# Altium schematic sheet NGUON.SchDoc
size 254 x 241 mm
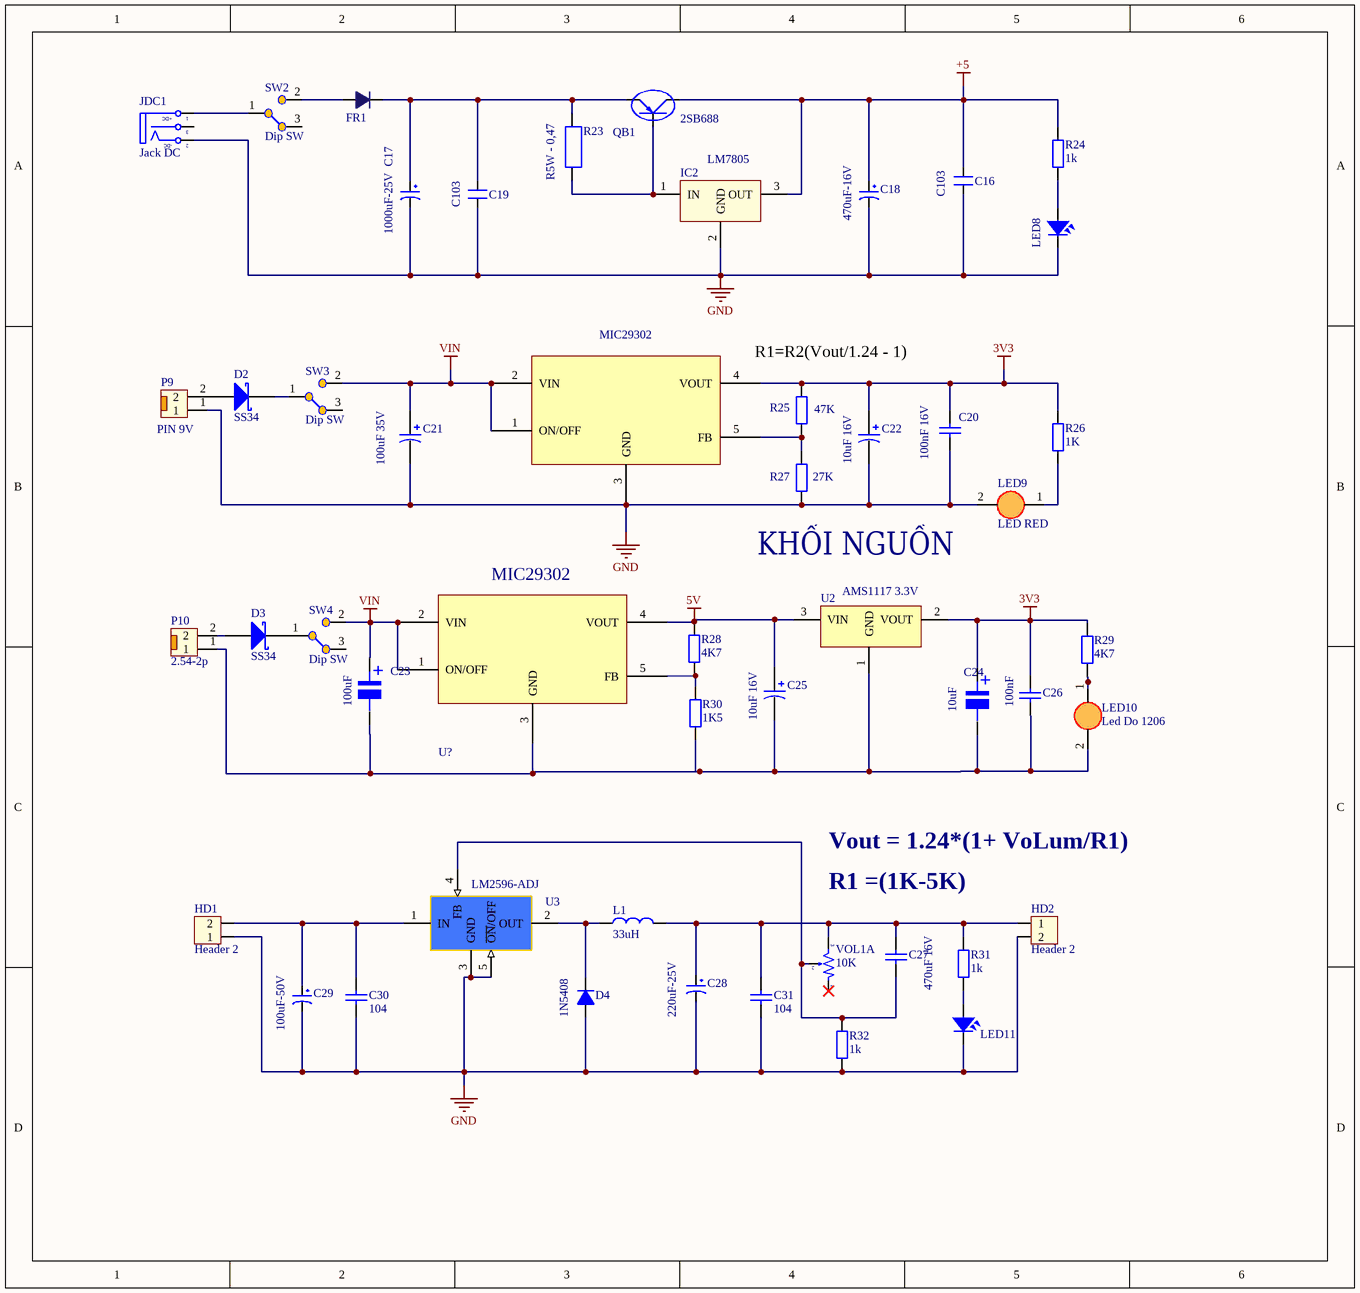
[diagram p0: NGUON.SchDoc]

## Parts
C16  C103  [CN1]
C17  1000uF-25V  [tu hoa 13mm]
C18  470uF-16V  [tu hoa 8mm]
C19  C103  [CN1]
C20  100nF 16V  [tu 0805]
C21  100uF 35V  [CAP_ALUM_SMD_100102_TYPE_G]
C22  10uF 16V  [CAP_ALUM_SMD_5054_TYPE_C]
C23  100uF  [tu nhom 10 (g)]
C24  10uF  [tu nhom 4 (b)]
C25  10uF 16V  [CAP_ALUM_SMD_5054_TYPE_C]
C26  100nF  [tu 0805]
C27  470uF 16V  [tu gom]
C28  220uF-25V  [Tu hoa 8mm]
C29  100uF-50V  [tu hoa 8mm]
C30  104  [tu gom]
C31  104  [tu gom]
D2  SS34  [DIODE_DO214AC_SMA]
D3  SS34  [DIODE_DO214AC_SMA]
D4  1N5408  [D5A]
FR1  Diode FR307  [FR307]  (value not drawn)
HD1  Header 2  [HED2]
HD2  Header 2  [HED2]
IC2  LM7805  [QTO-220H3]
JDC1  Jack DC  [DC-IN]
L1  33uH  [R1/4W]
LED8  LED  [LED-5-RED]  (value not drawn)
LED9  LED RED  [led 0805]
LED10  Led Do 1206  [led 1206]
LED11  LED  [LED-5-RED]  (value not drawn)
MIC2  MIC29302  [Mic5V]
MIC3  U?  [Mic5V]
P9  PIN 9V  [Header Duc Thang 2P 2.54]
P10  2.54-2p  [Header Duc Thang 2P 2.54]
QB1  2SB688  [QTO-247]
R23  R5W - 0,47  [R5W]
R24  1k  [R1/4W]
R25  47K  [tro 0805]
R26  1K  [tro 0805]
R27  27K  [tro 0805]
R28  4K7  [tro 0805]
R29  4K7  [tro 0805]
R30  1K5  [tro 0805]
R31  1k  [R1/4W]
R32  1k  [R1/4W]
SW2  Dip SW  [SW3P]
SW3  Dip SW  [SW3P]
SW4  Dip SW  [SW3P]
U2  AMS1117 3.3V  [SOT223]
U3  LM2596-ADJ  [D2-PACK5]
VOL1  10K  [VR1]  (part A of 2)

## Nets
3V3: C20.1 C22.1 C24.1 C26.1 MIC2.4(VOUT) R25.1 R26.2 R29.1 U2.2(VOUT)
5V: C25.1 MIC3.4(VOUT) R28.2 U2.3(VIN)
+5: C16.2 C18.1 IC2.3(OUT) QB1.2(C) R24.2
GND: C16.1 C17.2 C18.2 C19.1 C20.2 C21.2 C22.2 C28.2 C29.2 C30.2 C31.2 D4.1(A) HD1.1 HD2.2 IC2.2(GND) JDC1.2(TN) LED8.2 LED9.2(K) LED11.2 MIC2.3(GND) P9.1 R27.2 R32.1 U3.3(GND) U3.5(~{ON}/OFF)
VIN: C21.1 C23.1 MIC2.1(ON/OFF) MIC2.2(VIN) MIC3.1(ON/OFF) MIC3.2(VIN) SW3.2(NC) SW4.2(NC)
NetC17_1: C17.1 C19.2 FR1.2(K) QB1.3(E) R23.2
NetC23_2: C23.2 C24.2 C25.2 C26.2 LED10.2(K) MIC3.3(GND) P10.1 R30.1 U2.1(GND)
NetC27_1: C27.1 C28.1 C31.1 HD2.1 L1.2 R31.2 VOL1.3
NetC27_2: C27.2 R32.2 U3.4(FB) VOL1.2
NetC29_1: C29.1 C30.1 HD1.2 U3.1(IN)
NetD2_1: D2.1(A) P9.2
NetD2_2: D2.2(K) SW3.1(COM)
NetD3_1: D3.1(A) P10.2
NetD3_2: D3.2(K) SW4.1(COM)
NetD4_2: D4.2(K) L1.1 U3.2(OUT)
NetFR1_1: FR1.1(A) SW2.2(NC)
NetIC2_1: IC2.1(IN) QB1.1(B) R23.1
NetJDC1_1: JDC1.1(T) SW2.1(COM)
NetLED8_1: LED8.1 R24.1
NetLED9_1: LED9.1(A) R26.1
NetLED10_1: LED10.1(A) R29.2
NetLED11_1: LED11.1 R31.1
NetMIC2_5: MIC2.5(FB) R25.2 R27.1
NetMIC3_5: MIC3.5(FB) R28.1 R30.2

Not connected (* = marked no-connect by the designer): JDC1 3(S); SW2 3(NO); SW3 3(NO); SW4 3(NO); VOL1 1*

## Notes on the sheet
- R1=R2(Vout/1.24 - 1)
- KHỐI NGUỒN
- (near MIC3) MIC29302
- Vout = 1.24*(1+ VoLum/R1)
- R1 =(1K-5K)
- (in symbol Jack DC) +DC; -DC
- (in symbol Tu Nhom 10uF 16V) +
- (in symbol Tu Nhom 100uF 35V) +

## Library data of the parts
C16 C19 = CN1: Cap np  1pF - 472pF; Value: 100pF
C17 = Tu Hoa 1000uF 25V 13x21: Cắm; Don_Vi: Con; So_Chan: 2; Ten_Linh_Kien: Tụ Hóa 1000uF 25V 13x21MM; Ma_Hang: MH002315; Chung_Loai: Cắm; Kieu_Chan: *
C18 = Tu Hoa 470uF 16V 8x11: Cắm; Don_Vi: Con; So_Chan: 2; Ten_Linh_Kien: Tụ Hóa 470uF 16V 8x11MM; Ma_Hang: MH006550; Chung_Loai: Cắm; Kieu_Chan: *
C20 = Tu 0805 22pF 50V 10%: Dán; Don_Vi: Con; So_Chan: 2; Ten_Linh_Kien: Tụ 0805 22P 10% 50V; Ma_Hang: MH004560; Chung_Loai: Dán; Kieu_Chan: *
C21 = EEE-FK1C331P: CAP ALUM 330uF 20% 35V SMD; MFR: Panasonic; Value: 330uF/35V; Solder: SMT; MPN: EEE-FK1C331P; Category: CAPACITOR; PinCount: 2
C22 C25 = EEE-FK1C330P: CAP ALUM 33uF 20% 16V SMD; MFR: Panasonic; Value: 33uF/16V; Solder: SMT; MPN: EEE-FK1C330P; Category: CAPACITOR; PinCount: 2
C23 = Tu Nhom 100uF 35V: Dán; Don_Vi: Con; Ten_Linh_Kien: Tụ Nhôm 100uF 35V; Ma_Hang: MH004019; So_Chan: 2; Chung_Loai: Dán; Kieu_Chan: *
C24 = Tu Nhom 10uF 16V: Dán; Don_Vi: Con; So_Chan: 2; Ten_Linh_Kien: Tụ Nhôm 10uF 16V 4x5MM; Ma_Hang: MH001458; Chung_Loai: Dán; Kieu_Chan: *
C26 = Tu 0805 220nF 50V 10%: Dán; Don_Vi: Con; So_Chan: 2; Ten_Linh_Kien: Tụ 0805 220nF 50V 10%; Ma_Hang: MH008099; Chung_Loai: Dán; Kieu_Chan: *
C27 C30 C31 = Tu gom 100 50V: Cắm; Don_Vi: Con; So_Chan: 2; Ten_Linh_Kien: Tụ gốm 100 10pF 50V; Ma_Hang: MH004765; Chung_Loai: Cắm; Kieu_Chan: *
C28 = Tu Hoa 220uF 25V 8x10: Cắm; Don_Vi: Con; So_Chan: 2; Ten_Linh_Kien: Tụ Hóa 220uF 25V 8x10MM; Ma_Hang: MH006864; Chung_Loai: Cắm; Kieu_Chan: *
C29 = Tu Hoa 100uF 50V 8x11: Cắm; Don_Vi: Con; So_Chan: 2; Ten_Linh_Kien: Tụ Hóa 100uF 50V 8x11MM; Ma_Hang: MH006872; Chung_Loai: Cắm; Kieu_Chan: *
D2 D3 = SS34: DIODE SCHOTTKY 40V 3A SMA; Solder: SMT; MPN: SS34; Value: SS34; MFR: *
D4 = D5A: Diode 5A; Value: 1N5408
FR1 = Diode FR307: Diode RECT FAST REC 1000V 3A DO-201AD; Vendor: Digikey; Current: 3Amp; Published: 8-Jun-2000; LatestRevisionDate: 17-Jul-2002; LatestRevisionNote: Re-released for DXP Platform.; DatasheetDocument: 1997; PackageReference: DO-35; Publisher: Altium Limited; Code_JEDEC: DO-204-AH; ComponentLink1Description: Digikey Part Link; ComponentLink1URL: http://www.fairchildsemi.com/; ComponentLink2Description: Open Datasheet; ComponentLink2URL: H:\LIBRARY\LIBRARY.Datasheet\ds26003.pdf; Value: FR307
HD1 HD2 = Hed2: Header 2 (Green); Value: Header 2
IC2 = LM78xx: On ap +, from + 5 to + 24VDC; Value: LM7805
JDC1 = Jack DC: Cắm; Ten_Linh_Kien: Jack DC5.5x2.1MM DC5501; Ma_Hang: MH000923; Don_Vi: Con; Kieu_Chan: *; Ghi_Chu: *; Chung_Loai: Cắm
L1 = Cuon cam 220uH: Cắm; So_Chan: 2; Ten_Linh_Kien: Cuộn Cảm 220uH 3A 8x10MM; Ma_Hang: MH002208; Don_Vi: Con; Chung_Loai: Cắm; Kieu_Chan: *
LED8 LED11 = LED: LED Single colour Green and Red; Value: LED 3 ly Single Colour
LED9 = Led 0805 Do: Dán; Don_Vi: Con; So_Chan: 2; Ten_Linh_Kien: LED 0805 Màu Đỏ; Ma_Hang: MH000897; Chung_Loai: Dán; Kieu_Chan: *
LED10 = Led 1206 Do: Dán; Kieu_Chan: 1206; Ten_Linh_Kien: LED 1206 Màu Đỏ (Red); Ma_Hang: MH002334; Don_Vi: Con; So_Chan: 2; Chung_Loai: Dán
MIC2 MIC3 = Mic5V: 3A
P9 P10 = Header 2.54-2p Duc Thang: Cắm; So_Chan: 2; Don_Vi: Con; Ten_Linh_Kien: Header 2P XH2.54-2P Đực Thẳng; Ma_Hang: MH001283; Chung_Loai: Cắm; Kieu_Chan: *
QB1 = B688: Cắm; Ten_Linh_Kien: 2SB688 TO247; Don_Vi: Con; Ma_Hang: MH002914; Ghi_Chu: *; Kieu_Chan: *; Chung_Loai: Cắm
R23 = R5W: Resistor 5W; Value: R5W - 0,47R
R24 R31 R32 = R1/4W: Resistor 1/4W; Value: R1/4W - 1K
R25-R30 = Tro 0805 5% 10k: Dán; Don_Vi: Con; So_Chan: 2; Ten_Linh_Kien: Trở 0805 5% 10k; Ma_Hang: MH005239; Chung_Loai: Dán; Kieu_Chan: *
SW2-SW4 = Switch3P: Dip Switch 3 pin
U2 = AMS1117 3.3V: Dán; Ten_Linh_Kien: AMS1117-3.3V SOT223; Don_Vi: Con; So_Chan: 4; Ma_Hang: MH000596; Kieu_Chan: SOT223; Chung_Loai: Dán
U3 = LM2596: Simple Switcher 3A Step Down Voltage Regulator; Note: Tab is connected to GND; Published: 15-Apr-2002; DatasheetVersion: May-1999; PackageVersion: 2000; PackageReference: T05A; Publisher: Altium Limited; PackageDescription: TO, Thru-Hole, Vertical, Heatsink Mounted; 5 In-Line Leads; Pitch 1.70 mm; Code_JEDEC: TS-001-AA; ComponentLink1Description: Manufacturer Link; ComponentLink1URL: http://www.national.com/; ComponentLink2Description: Datasheet; ComponentLink2URL: H:\LIBRARY\LIBRARY.Datasheet\LM2576.pdf; ComponentLink3Description: URL Link1; ComponentLink3URL: http://www.national.com/pf/LM/LM2575HV.html; Price: 15000 VND
VOL1 = VOL-D: Volume control Dual; Value: Volume Dual 50K